# Altium schematic sheet GD32F450_Power_Manager(Camera)_V1.0.SchDoc
size A4
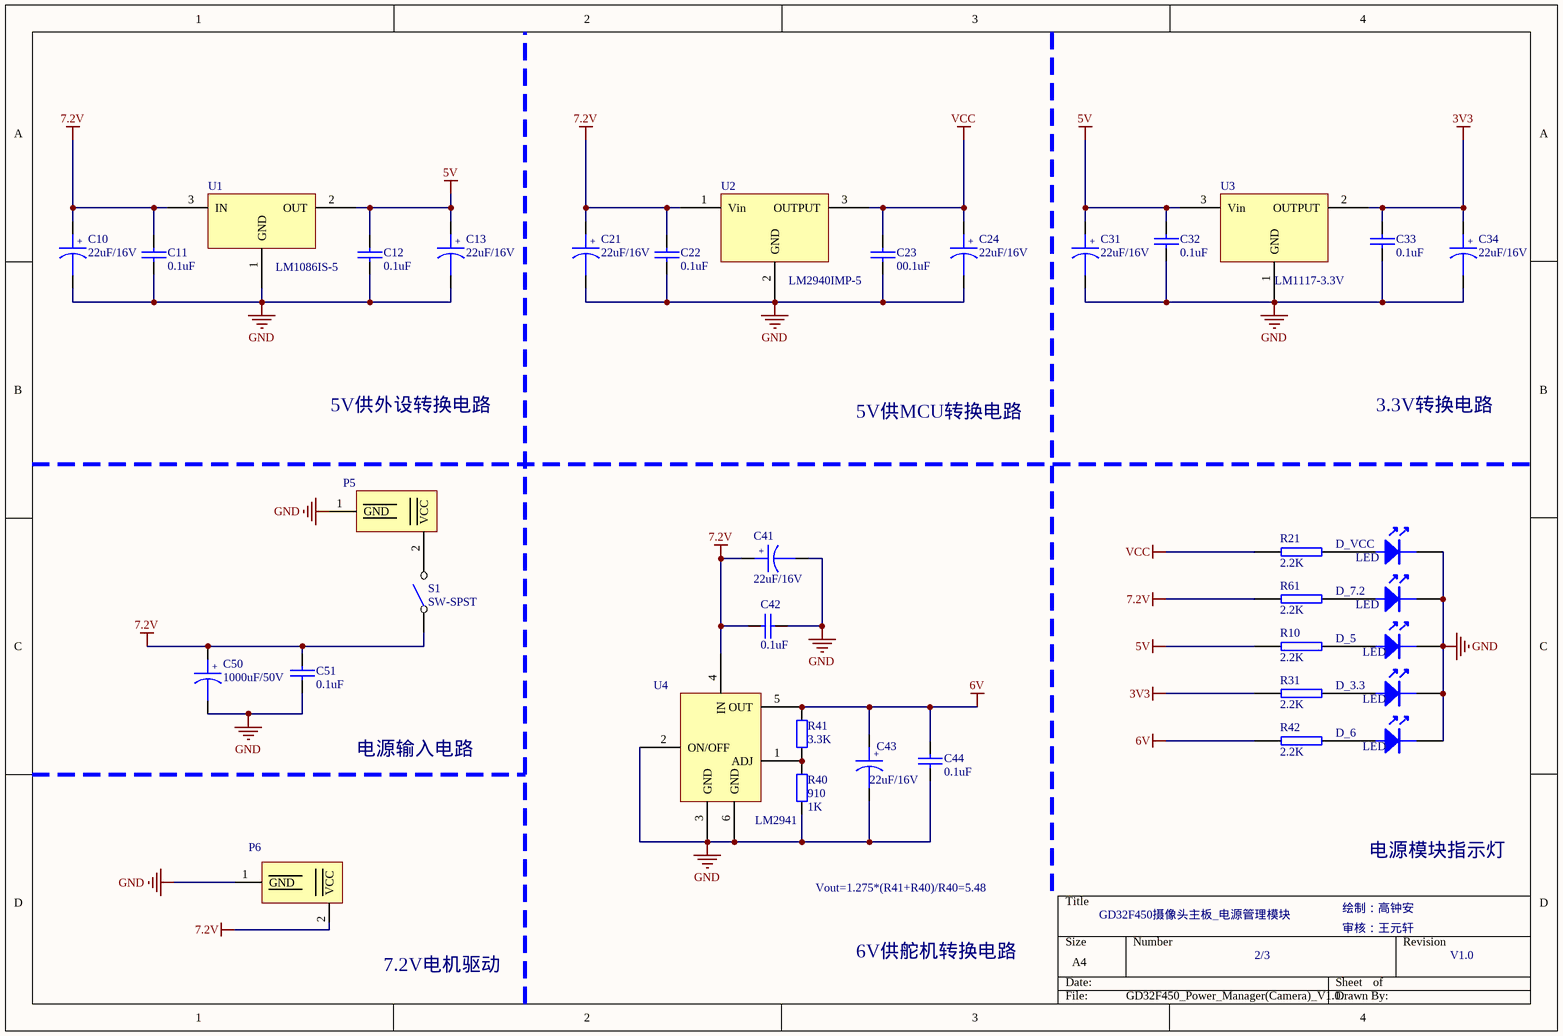
[diagram p0: GD32F450_Power_Manager(Camera)_V1.0.SchDoc]

## Parts
C10  22uF/16V  [3528]
C11  0.1uF  [0805C]
C12  0.1uF  [0805C]
C13  22uF/16V  [3528]
C21  22uF/16V  [3528]
C22  0.1uF  [0805C]
C23  00.1uF  [0805C]
C24  22uF/16V  [3528]
C31  22uF/16V  [3528]
C32  0.1uF  [0805C]
C33  0.1uF  [0805C]
C34  22uF/16V  [3528]
C41  22uF/16V  [3528]
C42  0.1uF  [0805C]
C43  22uF/16V  [3528]
C44  0.1uF  [0805C]
C50  1000uF/50V  [CM F(10*10.2)]
C51  0.1uF  [0805C]
D_3.3  LED  [1206LED]
D_5  LED  [1206LED]
D_6  LED  [1206LED]
D_7.2  LED  [1206LED]
D_VCC  LED  [1206LED]
P5  T_Type_Adapter  [T_Type_Adapter]  (value not drawn)
P6  T_Type_Adapter  [T_Type_Adapter]  (value not drawn)
R10  2.2K  [0805R]
R21  2.2K  [0805R]
R31  2.2K  [0805R]
R40  910  value 1K  [0805]
R41  3.3K  [0805]
R42  2.2K  [0805R]
R61  2.2K  [0805R]
S1  SW-SPST  [SWITCH-MINI]
U1  LM1086IS-5  [TO263-3A]
U2  LM2940IMP-5  [SOT-223]
U3  LM1117-3.3V  [SOT-223]
U4  LM2941  [TO-263]

## Nets
3V3: C33.1 C34.1 R31.1 U3.2(OUTPUT)
5V: C12.1 C13.1 C31.1 C32.1 R10.1 U1.2(OUT) U3.3(Vin)
6V: C43.1 C44.1 R41.2 R42.1 U4.5(OUT)
7.2V: C10.1 C11.1 C21.1 C22.1 C41.1 C42.1 C50.1 C51.1 P6.2(VCC) R61.1 S1.1 U1.3(IN) U2.1(Vin) U4.4(IN)
GND: C10.2 C11.2 C12.2 C13.2 C21.2 C22.2 C23.2 C24.2 C31.2 C32.2 C33.2 C34.2 C41.2 C42.2 C43.2 C44.2 C50.2 C51.2 D_3.3.K D_5.K D_6.K D_7.2.K D_VCC.K P5.1(GND) P6.1(GND) R40.1 U1.1(GND) U2.2(GND) U3.1(GND) U4.2(ON/OFF) U4.3(GND) U4.6(GND)
VCC: C23.1 C24.1 R21.1 U2.3(OUTPUT)
NetD_3.3_A: D_3.3.A R31.2
NetD_5_A: D_5.A R10.2
NetD_6_A: D_6.A R42.2
NetD_7.2_A: D_7.2.A R61.2
NetD_VCC_A: D_VCC.A R21.2
NetP5_2: P5.2(VCC) S1.2
NetR40_2: R40.2 R41.1 U4.1(ADJ)

## Notes on the sheet
- 5V供外设转换电路
- 5V供MCU转换电路
- 3.3V转换电路
- 电源输入电路
- Vout=1.275*(R41+R40)/R40=5.48
- GD32F450摄像头主板_电源管理模块
- 绘制：高钟安
- 电源模块指示灯
- 7.2V电机驱动
- 6V供舵机转换电路
- 2/3
- 审核：王元轩
- V1.0
- (in symbol CAPACITOR POL) +

## Library data of the parts
C10 C13 C21 C24 C31 C34 C41 C43 C50 = CAPACITOR POL: Capacitor
C11 C12 C22 C23 C32 C33 C42 C44 C51 = CAP: Capacitor
R10 R21 R31 R42 R61 = RES2
R40 R41 = Res2: Resistor; Published: 8-Jun-2000; LatestRevisionDate: 17-Jul-2002; LatestRevisionNote: Re-released for DXP Platform.; PackageReference: AXIAL-0.4; Publisher: Altium Limited; PackageDescription: Axial Device, Thru-Hole; 2 Leads; 0.4 in Pin Spacing
U1 = LT1086
U2 = LM1117-3.3V